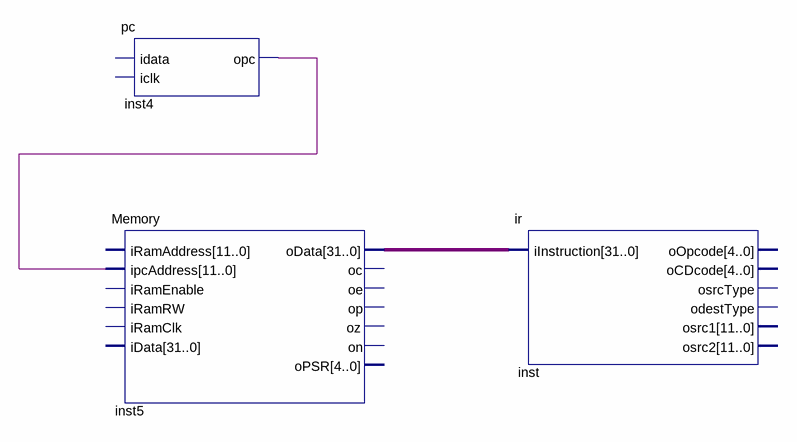
[diagram p0: schematic sheet]
// Quartus schematic cpu_design.bdf as structural Verilog: 3 symbols, 0 pins
module cpu_design (
);

  wire inst4_opc;
  wire [31:0] inst5_odata;

  pc inst4 (.opc(inst4_opc));  // open: idata, iclk
  Memory inst5 (
    .ipcAddress({12{inst4_opc}}), .oData(inst5_odata));  // open: iRamAddress, iRamEnable, iRamRW, iRamClk, iData, oc, oe, op, oz, on, oPSR
  ir inst (.iInstruction(inst5_odata));  // open: oOpcode, oCDcode, osrcType, odestType, osrc1, osrc2
endmodule
